# Altium schematic sheet LAB-02 Assignment.SchDoc
size A
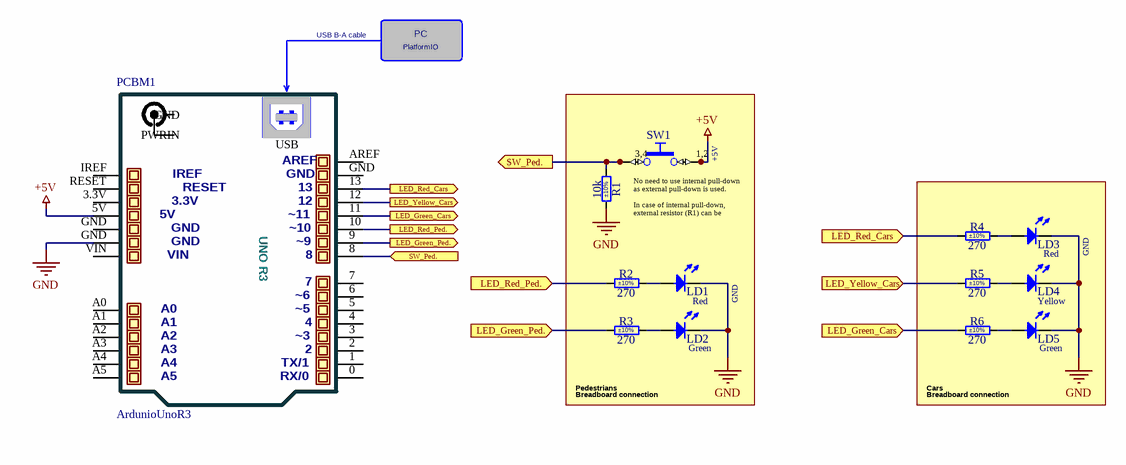
[diagram p0: LAB-02 Assignment.SchDoc]

## Parts
LD1  Red  [LED_DIALIGHT_561-2201-050F]
LD2  Green  [LED_DIALIGHT_561-2201-050F]
LD3  Red  [LED_DIALIGHT_561-2201-050F]
LD4  Yellow  [LED_DIALIGHT_561-2201-050F]
LD5  Green  [LED_DIALIGHT_561-2201-050F]
PCBM1  ArdunioUnoR3
R1  10k  Tolerance: ±10%  [RESC3216X65N]
R2  270  Tolerance: ±10%  [RESC3216X65N]
R3  270  Tolerance: ±10%  [RESC3216X65N]
R4  270  Tolerance: ±10%  [RESC3216X65N]
R5  270  Tolerance: ±10%  [RESC3216X65N]
R6  270  Tolerance: ±10%  [RESC3216X65N]
SW1  Push Button  [PB_ALPS_SKHHDTA010]  (value not drawn)

## Blocks framed on the sheet
GND: LD3-LD5 R4-R6

## Ports
LED_Green_Cars (in), LED_Green_Cars (out), LED_Green_Ped. (in), LED_Green_Ped. (out), LED_Red_Cars (in), LED_Red_Cars (out), LED_Red_Ped. (in), LED_Red_Ped. (out), LED_Yellow_Cars (in), LED_Yellow_Cars (out), SW_Ped. (in), SW_Ped. (out)

## Nets
+5V: PCBM1.5V SW1.1 SW1.2
GND: LD1.1(C) LD2.1(C) LD3.1(C) LD4.1(C) LD5.1(C) PCBM1.GND R1.1
LED_Green_Cars: PCBM1.11 R6.1 ; port LED_Green_Cars
LED_Green_Ped.: PCBM1.9 R3.1 ; port LED_Green_Ped.
LED_Red_Cars: PCBM1.13 R4.1 ; port LED_Red_Cars
LED_Red_Ped.: PCBM1.10 R2.1 ; port LED_Red_Ped.
LED_Yellow_Cars: PCBM1.12 R5.1 ; port LED_Yellow_Cars
SW_Ped.: PCBM1.8 R1.2 SW1.3 SW1.4 ; port SW_Ped.
NetLD1_2: LD1.2(A) R2.2
NetLD2_2: LD2.2(A) R3.2
NetLD3_2: LD3.2(A) R4.2
NetLD4_2: LD4.2(A) R5.2
NetLD5_2: LD5.2(A) R6.2

Not connected (* = marked no-connect by the designer): PCBM1 0 1 2 3 3.3V 4 5 6 7 A0 A1 A2 A3 A4 A5 AREF IREF RESET VIN

## Notes on the sheet
- USB B-A cable
- PC
- PlatformIO
- (near SW1) No need to use internal pull-down
  as external pull-down is used.
  In case of internal pull-down, external resistor (R1) can be omitted.
- (near SW1) +5V
- GND
- Breadboard connection
- Pedestrians
- Cars
- (in symbol ArdunioUnoR3) PWRIN; USB; ~11; UNO R3; ~10; ~9; ~6; ~5; ~3; TX/1; RX/0
- (in symbol PB_ALPS_SKHHDTA010) 3,4; 1,2

## Library data of the parts
LD1-LD5 = LED_DIALIGHT_561-2201-050F: LED Green 1C 2A; Part Description: Single Vertical 5mm HE Green LED With Housing Stand-off (D 7.1mmx H 6.985mm), Overall Height 12.7mm; PressFit: No; Bonding: No; Part Number: LED_DIALIGHT_561-2201-050F; Component Kind: Standard; Component Type: Standard; Color: Green; PackageDescription: Single Vertical 5mm HE Green LED With Housing Stand-off (D 7.1mmx H 6.985mm), Overall Height 12.7mm; Manufacturer: DIALIGHT; Manufacturer Part Number: 561-2201-050F; Pin Count: 2; Mounted: Yes; Socket: No; SMD: No; Sense: No; ComponentHeight: 12.7mm; HelpURL: \\cern.ch\dfs\Applications\Altium\Datasheets\LED_DIALIGHT_561-2201-050F.pdf; Author: CERN DEM JLC; CreateDate: 6. 6. 2018; LatestRevisionDate: 6. 6. 2018
PCBM1 = ArdunioUnoR3: ArdunioUnoR3 Universal SCH Symbol / (C) 230232
R1 = R1206_270R_0.1%_0.25W_25PPM: Resistor - 0.1%; Part Description: Thin Film Chip Resistor; Manufacturer: GENERIC; Manufacturer1 Part Number: RN73H2BTTD2700B25; Value: 270; Power: 0.25W; TC: ±25ppm/°C; PressFit: No; Part Number: R1206_270R_0.1%_0.25W_25PPM; Component Kind: Standard; Component Type: Standard; Pin Count: 2; Status: Not Recommended; Manufacturer Part Number: R1206_270R_0.1%_0.25W_25PPM; Case: 1206; Mounted: Yes; Sense: No; Socket: No; SMD: Yes; Manufacturer1 Example: KOA; Manufacturer1 ComponentHeight: 0.70mm; HelpURL: \\cern.ch\dfs\Applications\Altium\Datasheets\R1206_KOA_RN73H.pdf; Author: CERN DEM JLC; CreateDate: 3. 12. 2007; LatestRevisionDate: 13. 3. 2008
R2-R6 = R1206_270R_0.1%_0.25W_25PPM: Resistor - 0.1%; Part Description: Thin Film Chip Resistor; Manufacturer: GENERIC; Manufacturer1 Part Number: RN73H2BTTD2700B25; Power: 0.25W; TC: ±25ppm/°C; PressFit: No; Part Number: R1206_270R_0.1%_0.25W_25PPM; Component Kind: Standard; Component Type: Standard; Pin Count: 2; Value: 270; Status: Not Recommended; Manufacturer Part Number: R1206_270R_0.1%_0.25W_25PPM; Case: 1206; Mounted: Yes; Sense: No; Socket: No; SMD: Yes; Manufacturer1 Example: KOA; Manufacturer1 ComponentHeight: 0.70mm; HelpURL: \\cern.ch\dfs\Applications\Altium\Datasheets\R1206_KOA_RN73H.pdf; Author: CERN DEM JLC; CreateDate: 3. 12. 2007; LatestRevisionDate: 13. 3. 2008
SW1 = PB_ALPS_SKHHDTA010: Push-Button Switch SPDT; Part Description: 12VDC 50mA, 6x6mm Model, 13mm Stem Height Vertical Pushbutton Switch, ALPS SKHH Series; Manufacturer: ALPS; PressFit: No; Sense Comment: Non-washable; Part Number: PB_ALPS_SKHHDTA010; Component Kind: Standard; Component Type: Standard; Pin Count: 4; PackageDescription: 6x6mm Model, 13mm Stem Height Vertical Pushbutton Switch, ALPS SKHH Series; Family: Push Button; Mounted: Yes; Socket: No; SMD: No; Sense: Yes; Status: None; Manufacturer Part Number: SKHHDTA010; ComponentHeight: 13mm; HelpURL: \\cern.ch\dfs\Applications\Altium\Datasheets\PB_ALPS_SKHHDTA010.pdf; Author: CERN DEM JLC; CreateDate: 26. 9. 2013; LatestRevisionDate: 26. 9. 2013